# Altium schematic sheet MCU.SchDoc
size A4; SheetNumber: 6; SheetTotal: 6
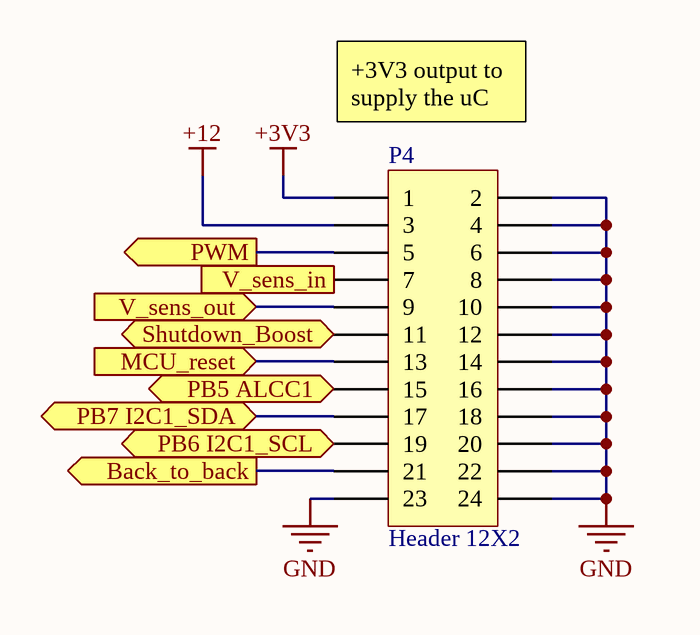
[diagram p0: MCU.SchDoc]

## Parts
P4  Header 12X2  [HDR2X12]

## Ports
Back_to_back (out), MCU_reset (in), PB5 ALCC1 (bidir), PB6 I2C1_SCL (bidir), PB7 I2C1_SDA (bidir), PWM (out), Shutdown_Boost (bidir), V_sens_in (in), V_sens_out (in)

## Nets
+3V3: P4.1
+12: P4.3
GND: P4.2 P4.4 P4.6 P4.8 P4.10 P4.12 P4.14 P4.16 P4.18 P4.20 P4.22 P4.23 P4.24
Back_to_back: P4.21 ; port Back_to_back
MCU_reset: P4.13 ; port MCU_reset
PB5 ALCC1: P4.15 ; port PB5 ALCC1
PB6 I2C1_SCL: P4.19 ; port PB6 I2C1_SCL
PB7 I2C1_SDA: P4.17 ; port PB7 I2C1_SDA
PWM: P4.5 ; port PWM
Shutdown_Boost: P4.11 ; port Shutdown_Boost
V_sens_in: P4.7 ; port V_sens_in
V_sens_out: P4.9 ; port V_sens_out

## Notes on the sheet
- (near P4) +3V3 output to supply the uC

## Library data of the parts
P4 = Header 12X2: Header, 12-Pin, Dual row; LatestRevisionDate: 17-Jul-2002; LatestRevisionNote: Re-released for DXP Platform.; Publisher: Altium Limited